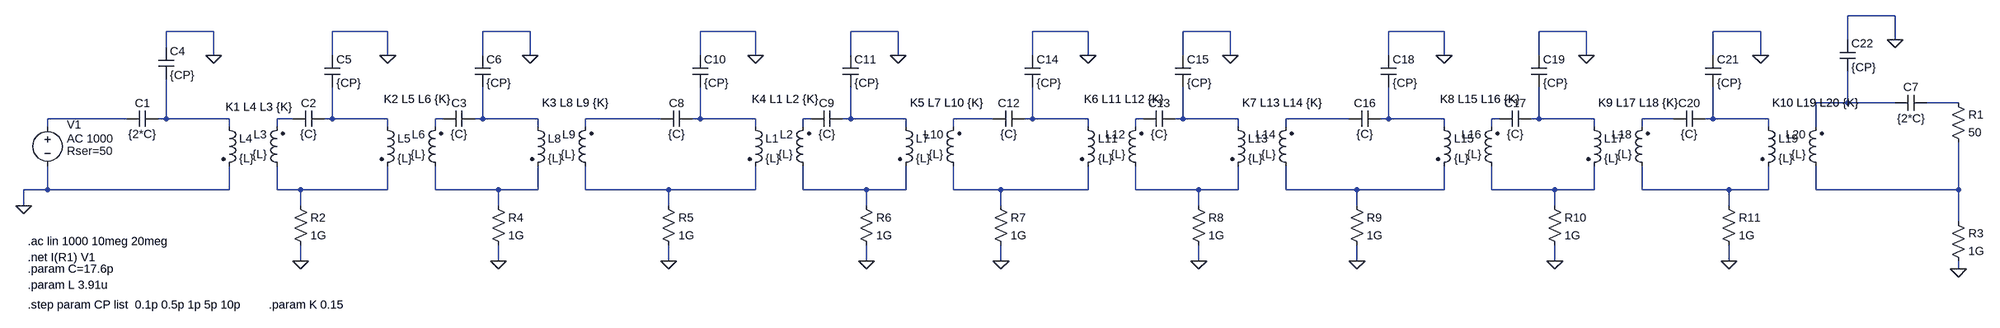
[diagram p0: schematic MI_fixCP.asc]
MI_fixCP.asc, the LTspice schematic file:
Version 4
SHEET 1 1260 680
WIRE 1072 -80 976 -80
WIRE -2368 -48 -2464 -48
WIRE -2016 -48 -2128 -48
WIRE -1728 -48 -1824 -48
WIRE -1232 -48 -1344 -48
WIRE -944 -48 -1040 -48
WIRE -560 -48 -672 -48
WIRE -272 -48 -368 -48
WIRE 160 -48 48 -48
WIRE 448 -48 352 -48
WIRE 800 -48 704 -48
WIRE 976 -32 976 -80
WIRE 1072 -32 1072 -80
WIRE -2464 -16 -2464 -48
WIRE -2368 0 -2368 -48
WIRE -2128 0 -2128 -48
WIRE -2016 0 -2016 -48
WIRE -1824 0 -1824 -48
WIRE -1728 0 -1728 -48
WIRE -1344 0 -1344 -48
WIRE -1232 0 -1232 -48
WIRE -1040 0 -1040 -48
WIRE -944 0 -944 -48
WIRE -672 0 -672 -48
WIRE -560 0 -560 -48
WIRE -368 0 -368 -48
WIRE -272 0 -272 -48
WIRE 48 0 48 -48
WIRE 160 0 160 -48
WIRE 352 0 352 -48
WIRE 448 0 448 -48
WIRE 704 0 704 -48
WIRE 800 0 800 -48
WIRE 976 96 976 32
WIRE 976 96 912 96
WIRE 1072 96 976 96
WIRE 1200 96 1136 96
WIRE -2544 128 -2704 128
WIRE -2464 128 -2464 48
WIRE -2464 128 -2480 128
WIRE -2336 128 -2464 128
WIRE -2208 128 -2240 128
WIRE -2128 128 -2128 64
WIRE -2128 128 -2144 128
WIRE -2016 128 -2128 128
WIRE -1904 128 -1920 128
WIRE -1824 128 -1824 64
WIRE -1824 128 -1840 128
WIRE -1712 128 -1824 128
WIRE -1424 128 -1616 128
WIRE -1344 128 -1344 64
WIRE -1344 128 -1360 128
WIRE -1232 128 -1344 128
WIRE -1120 128 -1136 128
WIRE -1040 128 -1040 64
WIRE -1040 128 -1056 128
WIRE -928 128 -1040 128
WIRE -752 128 -832 128
WIRE -672 128 -672 64
WIRE -672 128 -688 128
WIRE -560 128 -672 128
WIRE -448 128 -464 128
WIRE -368 128 -368 64
WIRE -368 128 -384 128
WIRE -256 128 -368 128
WIRE -32 128 -160 128
WIRE 48 128 48 64
WIRE 48 128 32 128
WIRE 160 128 48 128
WIRE 272 128 256 128
WIRE 352 128 352 64
WIRE 352 128 336 128
WIRE 464 128 352 128
WIRE 624 128 560 128
WIRE 704 128 704 64
WIRE 704 128 688 128
WIRE 816 128 704 128
WIRE -2704 144 -2704 128
WIRE -2336 144 -2336 128
WIRE -2240 144 -2240 128
WIRE -2016 144 -2016 128
WIRE -1920 144 -1920 128
WIRE -1712 144 -1712 128
WIRE -1616 144 -1616 128
WIRE -1232 144 -1232 128
WIRE -1136 144 -1136 128
WIRE -928 144 -928 128
WIRE -832 144 -832 128
WIRE -560 144 -560 128
WIRE -464 144 -464 128
WIRE -256 144 -256 128
WIRE -160 144 -160 128
WIRE 160 144 160 128
WIRE 256 144 256 128
WIRE 464 144 464 128
WIRE 560 144 560 128
WIRE 816 144 816 128
WIRE 912 144 912 96
WIRE -2704 272 -2704 224
WIRE -2704 272 -2752 272
WIRE -2336 272 -2336 224
WIRE -2336 272 -2704 272
WIRE -2240 272 -2240 224
WIRE -2192 272 -2240 272
WIRE -2016 272 -2016 224
WIRE -2016 272 -2192 272
WIRE -1920 272 -1920 224
WIRE -1792 272 -1920 272
WIRE -1712 272 -1712 224
WIRE -1712 272 -1792 272
WIRE -1616 272 -1616 224
WIRE -1408 272 -1616 272
WIRE -1232 272 -1232 224
WIRE -1232 272 -1408 272
WIRE -1136 272 -1136 224
WIRE -1008 272 -1136 272
WIRE -928 272 -928 224
WIRE -928 272 -1008 272
WIRE -832 272 -832 224
WIRE -736 272 -832 272
WIRE -560 272 -560 224
WIRE -560 272 -736 272
WIRE -464 272 -464 224
WIRE -336 272 -464 272
WIRE -256 272 -256 224
WIRE -256 272 -336 272
WIRE -160 272 -160 224
WIRE -16 272 -160 272
WIRE 160 272 160 224
WIRE 160 272 -16 272
WIRE 256 272 256 224
WIRE 384 272 256 272
WIRE 464 272 464 224
WIRE 464 272 384 272
WIRE 560 272 560 224
WIRE 736 272 560 272
WIRE 816 272 816 224
WIRE 816 272 736 272
WIRE 912 272 912 224
WIRE 1200 272 1200 176
WIRE 1200 272 912 272
WIRE -2752 304 -2752 272
WIRE -2192 304 -2192 272
WIRE -1792 304 -1792 272
WIRE -1408 304 -1408 272
WIRE -1008 304 -1008 272
WIRE -736 304 -736 272
WIRE -336 304 -336 272
WIRE -16 304 -16 272
WIRE 384 304 384 272
WIRE 736 304 736 272
WIRE 1200 336 1200 272
WIRE -2192 416 -2192 384
WIRE -1792 416 -1792 384
WIRE -1408 416 -1408 384
WIRE -1008 416 -1008 384
WIRE -736 416 -736 384
WIRE -336 416 -336 384
WIRE -16 416 -16 384
WIRE 384 416 384 384
WIRE 736 416 736 384
WIRE 1200 432 1200 416
FLAG -2752 304 0
FLAG 1200 432 0
FLAG -2192 416 0
FLAG -1792 416 0
FLAG -2368 0 0
FLAG -2016 0 0
FLAG -1728 0 0
FLAG -1408 416 0
FLAG -1008 416 0
FLAG -1232 0 0
FLAG -944 0 0
FLAG -736 416 0
FLAG -336 416 0
FLAG -560 0 0
FLAG -272 0 0
FLAG -16 416 0
FLAG 384 416 0
FLAG 160 0 0
FLAG 448 0 0
FLAG 736 416 0
FLAG 800 0 0
FLAG 1072 -32 0
SYMBOL voltage -2704 128 R0
WINDOW 0 39 12 Left 2
WINDOW 123 39 40 Left 2
WINDOW 39 39 65 Left 2
SYMATTR InstName V1
SYMATTR Value2 AC 1000
SYMATTR SpiceLine Rser=50
SYMATTR Value ""
SYMBOL res 1184 80 R0
SYMATTR InstName R1
SYMATTR Value 50
SYMBOL ind2 -2224 240 R180
WINDOW 0 36 80 Left 2
WINDOW 3 36 40 Left 2
SYMATTR InstName L3
SYMATTR Value {L}
SYMATTR Type ind
SYMBOL res 1184 320 R0
SYMATTR InstName R3
SYMATTR Value 1G
SYMBOL ind2 -2352 128 R0
SYMATTR InstName L4
SYMATTR Value {L}
SYMATTR Type ind
SYMBOL cap -2480 112 R90
WINDOW 0 0 32 VBottom 2
WINDOW 3 32 32 VTop 2
SYMATTR InstName C1
SYMATTR Value {2*C}
SYMBOL cap -2144 112 R90
WINDOW 0 0 32 VBottom 2
WINDOW 3 32 32 VTop 2
SYMATTR InstName C2
SYMATTR Value {C}
SYMBOL ind2 -2032 128 R0
SYMATTR InstName L5
SYMATTR Value {L}
SYMATTR Type ind
SYMBOL ind2 -1904 240 R180
WINDOW 0 36 80 Left 2
WINDOW 3 36 40 Left 2
SYMATTR InstName L6
SYMATTR Value {L}
SYMATTR Type ind
SYMBOL res -2208 288 R0
SYMATTR InstName R2
SYMATTR Value 1G
SYMBOL cap -1840 112 R90
WINDOW 0 0 32 VBottom 2
WINDOW 3 32 32 VTop 2
SYMATTR InstName C3
SYMATTR Value {C}
SYMBOL ind2 -1728 128 R0
SYMATTR InstName L8
SYMATTR Value {L}
SYMATTR Type ind
SYMBOL ind2 -1600 240 R180
WINDOW 0 36 80 Left 2
WINDOW 3 36 40 Left 2
SYMATTR InstName L9
SYMATTR Value {L}
SYMATTR Type ind
SYMBOL res -1808 288 R0
SYMATTR InstName R4
SYMATTR Value 1G
SYMBOL cap -2480 -16 R0
SYMATTR InstName C4
SYMATTR Value {CP}
SYMBOL cap -2144 0 R0
SYMATTR InstName C5
SYMATTR Value {CP}
SYMBOL cap -1840 0 R0
SYMATTR InstName C6
SYMATTR Value {CP}
SYMBOL cap 1136 80 R90
WINDOW 0 0 32 VBottom 2
WINDOW 3 32 32 VTop 2
SYMATTR InstName C7
SYMATTR Value {2*C}
SYMBOL cap -1360 112 R90
WINDOW 0 0 32 VBottom 2
WINDOW 3 32 32 VTop 2
SYMATTR InstName C8
SYMATTR Value {C}
SYMBOL ind2 -1248 128 R0
SYMATTR InstName L1
SYMATTR Value {L}
SYMATTR Type ind
SYMBOL ind2 -1120 240 R180
WINDOW 0 36 80 Left 2
WINDOW 3 36 40 Left 2
SYMATTR InstName L2
SYMATTR Value {L}
SYMATTR Type ind
SYMBOL res -1424 288 R0
SYMATTR InstName R5
SYMATTR Value 1G
SYMBOL cap -1056 112 R90
WINDOW 0 0 32 VBottom 2
WINDOW 3 32 32 VTop 2
SYMATTR InstName C9
SYMATTR Value {C}
SYMBOL ind2 -944 128 R0
SYMATTR InstName L7
SYMATTR Value {L}
SYMATTR Type ind
SYMBOL ind2 -816 240 R180
WINDOW 0 36 80 Left 2
WINDOW 3 36 40 Left 2
SYMATTR InstName L10
SYMATTR Value {L}
SYMATTR Type ind
SYMBOL res -1024 288 R0
SYMATTR InstName R6
SYMATTR Value 1G
SYMBOL cap -1360 0 R0
SYMATTR InstName C10
SYMATTR Value {CP}
SYMBOL cap -1056 0 R0
SYMATTR InstName C11
SYMATTR Value {CP}
SYMBOL cap -688 112 R90
WINDOW 0 0 32 VBottom 2
WINDOW 3 32 32 VTop 2
SYMATTR InstName C12
SYMATTR Value {C}
SYMBOL ind2 -576 128 R0
SYMATTR InstName L11
SYMATTR Value {L}
SYMATTR Type ind
SYMBOL ind2 -448 240 R180
WINDOW 0 36 80 Left 2
WINDOW 3 36 40 Left 2
SYMATTR InstName L12
SYMATTR Value {L}
SYMATTR Type ind
SYMBOL res -752 288 R0
SYMATTR InstName R7
SYMATTR Value 1G
SYMBOL cap -384 112 R90
WINDOW 0 0 32 VBottom 2
WINDOW 3 32 32 VTop 2
SYMATTR InstName C13
SYMATTR Value {C}
SYMBOL ind2 -272 128 R0
SYMATTR InstName L13
SYMATTR Value {L}
SYMATTR Type ind
SYMBOL ind2 -144 240 R180
WINDOW 0 36 80 Left 2
WINDOW 3 36 40 Left 2
SYMATTR InstName L14
SYMATTR Value {L}
SYMATTR Type ind
SYMBOL res -352 288 R0
SYMATTR InstName R8
SYMATTR Value 1G
SYMBOL cap -688 0 R0
SYMATTR InstName C14
SYMATTR Value {CP}
SYMBOL cap -384 0 R0
SYMATTR InstName C15
SYMATTR Value {CP}
SYMBOL cap 32 112 R90
WINDOW 0 0 32 VBottom 2
WINDOW 3 32 32 VTop 2
SYMATTR InstName C16
SYMATTR Value {C}
SYMBOL ind2 144 128 R0
SYMATTR InstName L15
SYMATTR Value {L}
SYMATTR Type ind
SYMBOL ind2 272 240 R180
WINDOW 0 36 80 Left 2
WINDOW 3 36 40 Left 2
SYMATTR InstName L16
SYMATTR Value {L}
SYMATTR Type ind
SYMBOL res -32 288 R0
SYMATTR InstName R9
SYMATTR Value 1G
SYMBOL cap 336 112 R90
WINDOW 0 0 32 VBottom 2
WINDOW 3 32 32 VTop 2
SYMATTR InstName C17
SYMATTR Value {C}
SYMBOL ind2 448 128 R0
SYMATTR InstName L17
SYMATTR Value {L}
SYMATTR Type ind
SYMBOL ind2 576 240 R180
WINDOW 0 36 80 Left 2
WINDOW 3 36 40 Left 2
SYMATTR InstName L18
SYMATTR Value {L}
SYMATTR Type ind
SYMBOL res 368 288 R0
SYMATTR InstName R10
SYMATTR Value 1G
SYMBOL cap 32 0 R0
SYMATTR InstName C18
SYMATTR Value {CP}
SYMBOL cap 336 0 R0
SYMATTR InstName C19
SYMATTR Value {CP}
SYMBOL cap 688 112 R90
WINDOW 0 0 32 VBottom 2
WINDOW 3 32 32 VTop 2
SYMATTR InstName C20
SYMATTR Value {C}
SYMBOL ind2 800 128 R0
SYMATTR InstName L19
SYMATTR Value {L}
SYMATTR Type ind
SYMBOL ind2 928 240 R180
WINDOW 0 36 80 Left 2
WINDOW 3 36 40 Left 2
SYMATTR InstName L20
SYMATTR Value {L}
SYMATTR Type ind
SYMBOL res 720 288 R0
SYMATTR InstName R11
SYMATTR Value 1G
SYMBOL cap 688 0 R0
SYMATTR InstName C21
SYMATTR Value {CP}
SYMBOL cap 960 -32 R0
SYMATTR InstName C22
SYMATTR Value {CP}
TEXT -2744 376 Left 2 !.ac lin 1000 10meg 20meg
TEXT -2744 408 Left 2 !.net I(R1) V1
TEXT -2344 104 Left 2 !K1 L4 L3 {K}
TEXT -2744 432 Left 2 !.param C=17.6p
TEXT -2744 464 Left 2 !.param L 3.91u
TEXT -2024 88 Left 2 !K2 L5 L6 {K}
TEXT -1704 96 Left 2 !K3 L8 L9 {K}
TEXT -2744 504 Left 2 !.step param CP list  0.1p 0.5p 1p 5p 10p
TEXT -2256 504 Left 2 !.param K 0.15
TEXT -1240 88 Left 2 !K4 L1 L2 {K}
TEXT -920 96 Left 2 !K5 L7 L10 {K}
TEXT -568 88 Left 2 !K6 L11 L12 {K}
TEXT -248 96 Left 2 !K7 L13 L14 {K}
TEXT 152 88 Left 2 !K8 L15 L16 {K}
TEXT 472 96 Left 2 !K9 L17 L18 {K}
TEXT 824 96 Left 2 !K10 L19 L20 {K}

The netlist it stands for:
* MI_fixCP.asc
V1 N003 0 AC 1000 Rser=50
R1 N002 N032 50
L3 N023 N005 {L}
R3 N032 0 1G
L4 N004 0 {L}
C1 N004 N003 {2*C}
C2 N006 N005 {C}
L5 N006 N023 {L}
L6 N024 N007 {L}
R2 N023 0 1G
C3 N008 N007 {C}
L8 N008 N024 {L}
L9 N025 N009 {L}
R4 N024 0 1G
C4 0 N004 {CP}
C5 0 N006 {CP}
C6 0 N008 {CP}
C7 N002 N001 {2*C}
C8 N010 N009 {C}
L1 N010 N025 {L}
L2 N026 N011 {L}
R5 N025 0 1G
C9 N012 N011 {C}
L7 N012 N026 {L}
L10 N027 N013 {L}
R6 N026 0 1G
C10 0 N010 {CP}
C11 0 N012 {CP}
C12 N014 N013 {C}
L11 N014 N027 {L}
L12 N028 N015 {L}
R7 N027 0 1G
C13 N016 N015 {C}
L13 N016 N028 {L}
L14 N029 N017 {L}
R8 N028 0 1G
C14 0 N014 {CP}
C15 0 N016 {CP}
C16 N018 N017 {C}
L15 N018 N029 {L}
L16 N030 N019 {L}
R9 N029 0 1G
C17 N020 N019 {C}
L17 N020 N030 {L}
L18 N031 N021 {L}
R10 N030 0 1G
C18 0 N018 {CP}
C19 0 N020 {CP}
C20 N022 N021 {C}
L19 N022 N031 {L}
L20 N032 N001 {L}
R11 N031 0 1G
C21 0 N022 {CP}
C22 0 N001 {CP}
.ac lin 1000 10meg 20meg
.net I(R1) V1
K1 L4 L3 {K}
.param C=17.6p
.param L 3.91u
K2 L5 L6 {K}
K3 L8 L9 {K}
.step param CP list  0.1p 0.5p 1p 5p 10p
.param K 0.15
K4 L1 L2 {K}
K5 L7 L10 {K}
K6 L11 L12 {K}
K7 L13 L14 {K}
K8 L15 L16 {K}
K9 L17 L18 {K}
K10 L19 L20 {K}
.backanno
.end